# Altium schematic sheet GEARDRONE_LITE.SchDoc
size A3
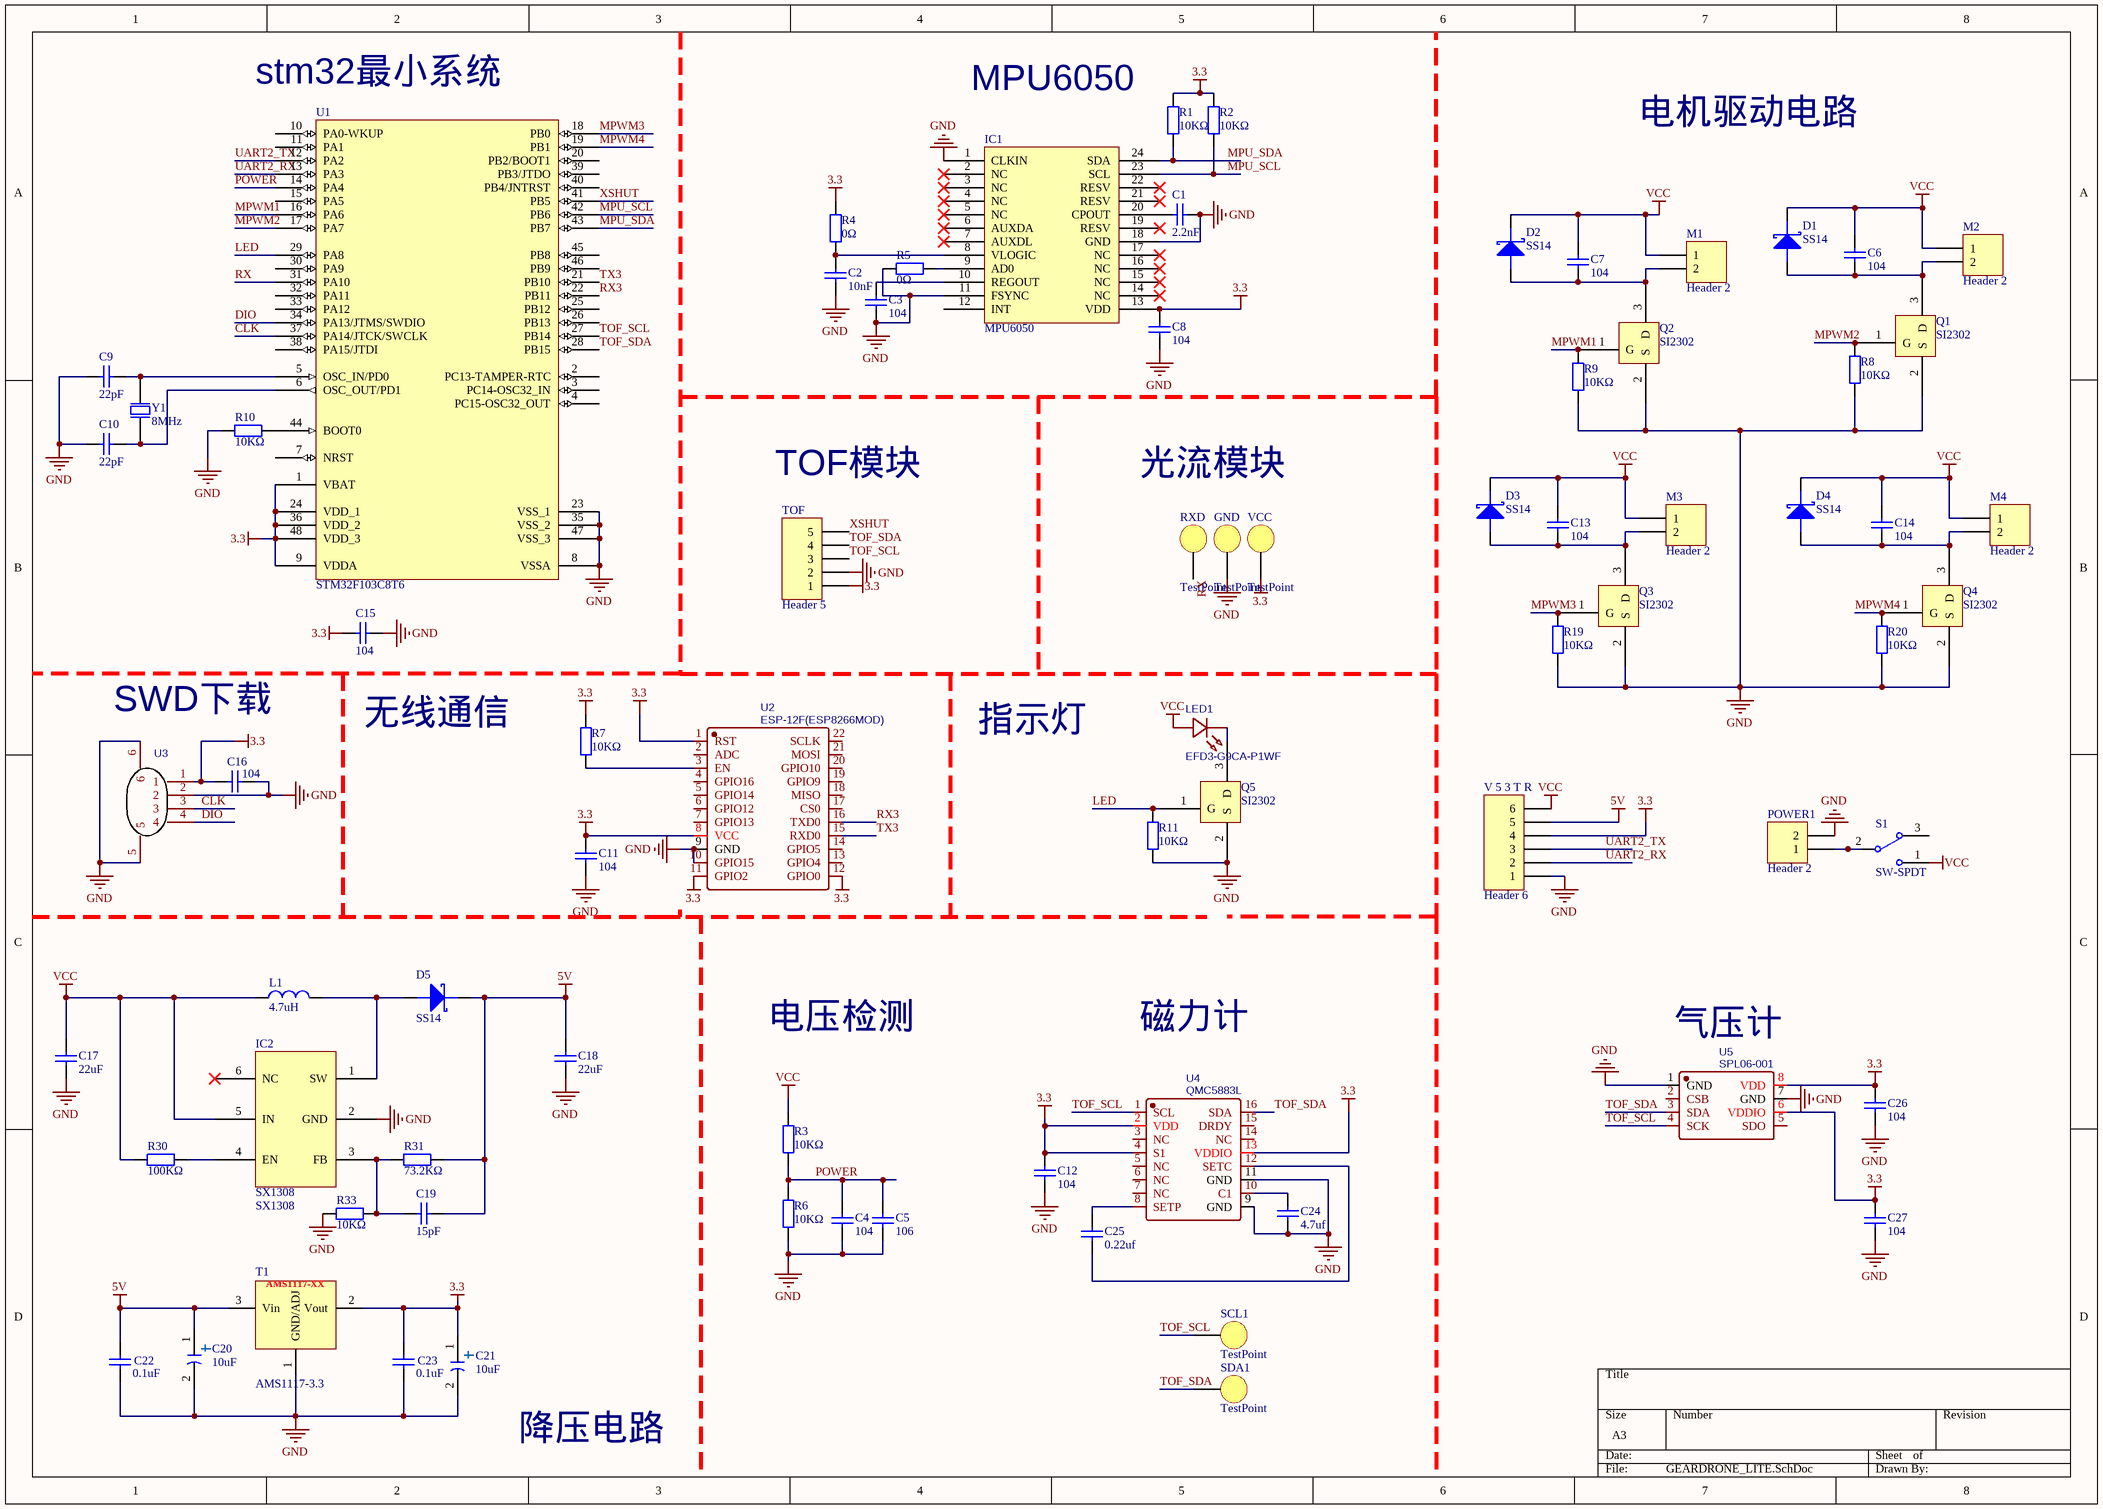
[diagram p0: GEARDRONE_LITE.SchDoc]

## Parts
C1  2.2nf  [C0603]
C2  10nf  [C0603]
C3  104  [C0603]
C4  104  [C0603]
C5  106  [C0603]
C6  104  [C0603]
C7  104  [C0603]
C8  104  [C0603]
C9  value 22pF  [C0603]  (hidden comment: 20pf)
C10  22pF  [C0603]
C11  104  [0603_C]
C12  104  [0603_C]
C13  104  [C0603]
C14  104  [C0603]
C15  104  [C0603]
C16  104  [C0603]
C17  22uf  [C0603]
C18  22uf  [C0603]
C19  15pf  [C0603]
C20  ECAP  [TAN-A-3216]  (value not drawn)
C21  ECAP  [TAN-A-3216]  (value not drawn)
C22  0.1uf  [C0603]
C23  0.1uf  [C0603]
C24  4.7uf  [0603_C]
C25  0.22uf  [0603_C]
C26  104  [0603_C]
C27  104  [0603_C]
D1  SS14  [SOD-323]
D2  SS14  [SOD-323]
D3  SS14  [SOD-323]
D4  SS14  [SOD-323]
D5  SS14  [SOD-323]
GND  TestPoint  [TestPoint]
IC1  MPU6050  [LC-QFN-24_4x4x05P]
IC2  SX1308  [LC-SOT-23-6]
L1  4.7uH  [CD43NP]
LED1  EFD3-G9CA-P1WF  [LED3528]
M1  Header 2  [HDR1X2]
M2  Header 2  [HDR1X2]
M3  Header 2  [HDR1X2]
M4  Header 2  [HDR1X2]
POWER1  Header 2  [HDR1X2]
Q1  SI2302  [LC-SOT-23(SOT-23-3)]
Q2  SI2302  [LC-SOT-23(SOT-23-3)]
Q3  SI2302  [LC-SOT-23(SOT-23-3)]
Q4  SI2302  [LC-SOT-23(SOT-23-3)]
Q5  SI2302  [LC-SOT-23(SOT-23-3)]
R1  value 10KΩ  [R0603]  (hidden comment: 10k)
R2  value 10KΩ  [R0603]  (hidden comment: 10k)
R3  value 10KΩ  [R0603]  (hidden comment: 10k)
R4  value 0Ω  [R0603]  (hidden comment: 0)
R5  value 0Ω  [R0603]  (hidden comment: 0)
R6  value 10KΩ  [R0603]  (hidden comment: 10k)
R7  value 10KΩ  [0603_R]  (hidden comment: 10k)
R8  value 10KΩ  [R0603]  (hidden comment: 10k)
R9  value 10KΩ  [R0603]  (hidden comment: 10k)
R10  10kΩ  [R0603]
R11  value 10KΩ  [0603_R]  (hidden comment: 10k)
R19  value 10KΩ  [R0603]  (hidden comment: 10k)
R20  value 10KΩ  [R0603]  (hidden comment: 10k)
R30  value 100KΩ  [R0603]  (hidden comment: 100k)
R31  value 73.2KΩ  [R0603]  (hidden comment: 73.2k)
R33  value 10KΩ  [R0603]  (hidden comment: 10k)
RXD  TestPoint  [TestPoint]
S1  SW-SPDT  [SW-TH_SS-12D10L5]
SCL1  TestPoint  [TestPoint]
SDA1  TestPoint  [TestPoint]
T1  AMS1117-3.3  [SOT230P700X180-4N-LM2940]
TOF  Header 5  [HDR1X5]
U1  STM32F103C8T6  [LC-LQFP-48_7x7x05P]
U2  ESP-12F(ESP8266MOD)  [WIFIM-SMD_ESP-12F-ESP8266MOD]
U3  SM04B-GHS-TB(LF)(SN)  [CONN-SMD_4P-P1.25_SM04B-GHS-TB-LF-SN]  (value not drawn)
U4  QMC5883L  [LPCC-16_L3.0-W3.0-P0.50-BL]
U5  SPL06-001  [SENSOR-SMD_SPL06-001]
V_5_3_T_R  Header 6  [HDR1X6]
VCC  TestPoint  [TestPoint]
Y1  Frequency: 8MHz  [SMD5032-2]  (hidden comment: 5032)

## Nets
3.3: C8.1 C11.1 C12.1 C15.2 C16.2 C21.1 C23.2 C26.1 C27.1 IC1.13(VDD) R1.1 R2.1 R4.2 R7.1 T1.2(Vout) TOF.1 U1.1(VBAT) U1.9(VDDA) U1.24(VDD_1) U1.36(VDD_2) U1.48(VDD_3) U2.1(RST) U2.8(VCC) U2.11(GPIO2) U2.12(GPIO0) U3.1 U4.2(VDD) U4.4(S1) U4.13(VDDIO) U5.6(VDDIO) U5.8(VDD) V_5_3_T_R.4 VCC.1(TestPoint)
5V: C18.2 C19.1 C20.1 C22.2 D5.2(K) R31.2 T1.3(Vin) V_5_3_T_R.5
GND: C1.2 C2.1 C3.2 C4.2 C5.2 C8.2 C9.1 C10.1 C11.2 C12.2 C15.1 C16.1 C17.1 C18.1 C20.2 C21.2 C22.1 C23.1 C24.1 C26.2 C27.2 GND.1(TestPoint) IC1.1(CLKIN) IC1.11(FSYNC) IC1.18(GND) IC2.2(GND) POWER1.2 Q1.2(S) Q2.2(S) Q3.2(S) Q4.2(S) Q5.2(S) R5.1 R6.2 R8.2 R9.1 R10.1 R11.1 R19.2 R20.2 R33.2 T1.1(GND/ADJ) TOF.2 U1.8(VSSA) U1.23(VSS_1) U1.35(VSS_2) U1.47(VSS_3) U2.9(GND) U2.10(GPIO15) U3.2 U3.5 U3.6 U4.9(GND) U4.11(GND) U5.1(GND) U5.7(GND) V_5_3_T_R.1
VCC: C6.2 C7.2 C13.2 C14.2 C17.2 D1.2(K) D2.2(K) D3.2(K) D4.2(K) IC2.5(IN) L1.1 LED1.2(A) M1.1 M2.1 M3.1 M4.1 R3.1 R30.1 S1.1 V_5_3_T_R.6
CLK: U1.37(PA14/JTCK/SWCLK) U3.3
DIO: U1.34(PA13/JTMS/SWDIO) U3.4
LED: Q5.1(G) R11.2 U1.29(PA8)
MPU_SCL: IC1.23(SCL) R2.2 U1.42(PB6)
MPU_SDA: IC1.24(SDA) R1.2 U1.43(PB7)
MPWM1: Q2.1(G) R9.2 U1.16(PA6)
MPWM2: Q1.1(G) R8.1 U1.17(PA7)
MPWM3: Q3.1(G) R19.1 U1.18(PB0)
MPWM4: Q4.1(G) R20.1 U1.19(PB1)
POWER: C4.1 C5.1 R3.2 R6.1 U1.14(PA4)
RX: RXD.1(TestPoint) U1.31(PA10)
RX3: U1.22(PB11) U2.16(TXD0)
TOF_SCL: SCL1.1(TestPoint) TOF.3 U1.27(PB14) U4.1(SCL) U5.4(SCK)
TOF_SDA: SDA1.1(TestPoint) TOF.4 U1.28(PB15) U4.16(SDA) U5.3(SDA)
TX3: U1.21(PB10) U2.15(RXD0)
UART2_RX: U1.13(PA3) V_5_3_T_R.2
UART2_TX: U1.12(PA2) V_5_3_T_R.3
XSHUT: TOF.5 U1.41(PB5)
NetC1_1: C1.1 IC1.20(CPOUT)
NetC2_2: C2.2 IC1.8(VLOGIC) R4.1
NetC3_1: C3.1 IC1.10(REGOUT)
NetC6_1: C6.1 D1.1(A) M2.2 Q1.3(D)
NetC7_1: C7.1 D2.1(A) M1.2 Q2.3(D)
NetC9_2: C9.2 U1.5(OSC_IN/PD0) Y1.2(OSC2)
NetC10_2: C10.2 U1.6(OSC_OUT/PD1) Y1.1(OSC1)
NetC13_1: C13.1 D3.1(A) M3.2 Q3.3(D)
NetC14_1: C14.1 D4.1(A) M4.2 Q4.3(D)
NetC19_2: C19.2 IC2.3(FB) R31.1 R33.1
NetC24_2: C24.2 U4.10(C1)
NetC25_1: C25.1 U4.12(SETC)
NetC25_2: C25.2 U4.8(SETP)
NetD5_1: D5.1(A) IC2.1(SW) L1.2
NetIC1_9: IC1.9(AD0) R5.2
NetIC2_4: IC2.4(EN) R30.2
NetLED1_1: LED1.1(K) Q5.3(D)
NetPOWER1_1: POWER1.1 S1.2
NetR7_2: R7.2 U2.3(EN)
NetR10_2: R10.2 U1.44(BOOT0)

Not connected (* = marked no-connect by the designer): IC1 2(NC)* 3(NC)* 4(NC)* 5(NC)* 6(AUXDA)* 7(AUXDL)* 12(INT) 14(NC)* 15(NC)* 16(NC)* 17(NC)* 19(RESV)* 21(RESV)* 22(RESV)*; IC2 6(NC)*; S1 3; U1 2(PC13-TAMPER-RTC) 3(PC14-OSC32_IN) 4(PC15-OSC32_OUT) 7(NRST) 10(PA0-WKUP) 11(PA1) 15(PA5) 20(PB2/BOOT1) 25(PB12) 26(PB13) 30(PA9) 32(PA11) 33(PA12) 38(PA15/JTDI) 39(PB3/JTDO) 40(PB4/JNTRST) 45(PB8) 46(PB9); U2 2(ADC) 4(GPIO16) 5(GPIO14) 6(GPIO12) 7(GPIO13) 13(GPIO4) 14(GPIO5) 17(CS0) 18(MISO) 19(GPIO9) 20(GPIO10) 21(MOSI) 22(SCLK); U4 3(NC) 5(NC) 6(NC) 7(NC) 14(NC) 15(DRDY); U5 2(CSB) 5(SDO)

## Notes on the sheet
- (near U1) stm32最小系统
- MPU6050
- 电机驱动电路
- (near TOF) TOF模块
- 光流模块
- SWD下载
- 无线通信
- 指示灯
- 电压检测
- 磁力计
- (near U5) 气压计
- 降压电路
- (in symbol ECAP) 10uF

## Library data of the parts
C1-C8 C11-C19 C22-C27 = Cap Chip 0603: Polarized Capacitor (Radial); Published: 8-Jun-2000; Revision: July-2002: Re-released for DXP Platform.; Publisher: Altium Limited
  C1: Value: 2.2nF
  C2: Value: 10nF
  C3 C4 C6-C8 C11-C16 C26 C27: Value: 104
  C5: Value: 106
  C17 C18: Value: 22uF
  C19: Value: 15pF
  C22 C23: Value: 0.1uF
  C24: Value: 4.7uf
  C25: Value: 0.22uf
C9 C10 = Cap Chip 0805: Polarized Capacitor (Radial); Published: 8-Jun-2000; Revision: July-2002: Re-released for DXP Platform.; Publisher: Altium Limited
  C10: Value: 22pF
D1-D5 = DIODE-TVS
IC1 = MPU6050: 三轴陀螺仪
L1 = Inductor Chip: Inductor; Published: 8-Jun-2000; Revision: July-2002: Re-released for DXP Platform.; Publisher: Altium Limited; Value: 4.7uH
LED1 = EFD3-G9CA-P1WF: BOM_Manufacturer: APt; Contributor: LCSC; BOM_Supplier: LCSC; BOM_Supplier Part: C507038; BOM_Manufacturer Part: EFD3-G9CA-P1WF; BOM_JLCPCB Part Class: Extended Part; spicePre: L; spiceSymbolName: EFD3-G9CA-P1WF
M1-M4 POWER1 = Header 2: Header, 2-Pin; LatestRevisionDate: 17-Jul-2002; LatestRevisionNote: Re-released for DXP Platform.; Publisher: Altium Limited
Q1-Q5 = HANDSOME-SI2302-N
R1-R11 R19 R20 R30 R31 R33 = Resistor Chip 0805: Resistor; Published: 8-Jun-2000; Revision: July-2002: Re-released for DXP Platform.; Publisher: Altium Limited
  R10: Value: 10KΩ
S1 = SW-SPDT: SPDT Subminiature Toggle Switch, Right Angle Mounting, Vertical Actuation; Revision 1: Jul-2002: Re-released for DXP Platform.; Revision 2: 17-Dec-2003: Schematic revised, PCB Footprint replaced.; Published: 24-Mar-1999; Datasheet: Latest Revision: 05-Dec-2000; Publisher: Altium Limited
T1 = AMS1117-XX: AMS   800mA LOW DROPOUT VOLTAGE REGULATOR
TOF = Header 5: Header, 5-Pin; LatestRevisionDate: 17-Jul-2002; LatestRevisionNote: Re-released for DXP Platform.; Publisher: Altium Limited
U1 = STM32F103C8T6: STM32 ARM-based 32-bit MCU with 64 Kbytes Flash, 48-pin LQFP, Industrial Temperature; Published: *; DatasheetVersion: *; PackageVersion: *; PackageReference: *; Publisher: *; PackageDescription: *; ComponentLink1Description: *; ComponentLink1URL: *; ComponentLink2Description: *; ComponentLink2URL: *
U2 = ESP-12F(ESP8266MOD): BOM_Manufacturer: Ai-Thinker; BOM_Supplier: LCSC; BOM_Manufacturer Part: ESP-12F(ESP8266MOD); BOM_Supplier Part: C82891; BOM_JLCPCB Part Class: Extended Part; spicePre: U; spiceSymbolName: ESP-12F(ESP8266MOD)
U3 = SM04B-GHS-TB(LF)(SN): BOM_Manufacturer: JST Sales America; Contributor: LCSC; BOM_Supplier: LCSC; BOM_Supplier Part: C189895; BOM_Manufacturer Part: SM04B-GHS-TB(LF)(SN); BOM_JLCPCB Part Class: Extended Part; spicePre: U; spiceSymbolName: SM04B-GHS-TB(LF)(SN)
U4 = HMC5883L: BOM_Manufacturer: null; Contributor: LCSC; BOM_Supplier: LCSC; BOM_Supplier Part: C2859540; BOM_Manufacturer Part: HMC5883L; BOM_JLCPCB Part Class: Extended Part; spicePre: U; spiceSymbolName: HMC5883L
U5 = SPL06-001: BOM_Manufacturer: Goertek(歌尔); Contributor: LCSC; BOM_Supplier: LCSC; BOM_Supplier Part: C2684428; BOM_Manufacturer Part: SPL06-001; BOM_JLCPCB Part Class: Extended Part; spicePre: U; spiceSymbolName: SPL06-001
V_5_3_T_R = Header 6: Header, 6-Pin; LatestRevisionDate: 17-Jul-2002; LatestRevisionNote: Re-released for DXP Platform.; Publisher: Altium Limited
Y1 = XTAL: Crystal Oscillator; Published: 8-Jun-2000; Revision: July-2002: Re-released for DXP Platform.; Publisher: Altium Limited